# EAGLE design blimp_v1 - modified (EAGLE 9.6.2)
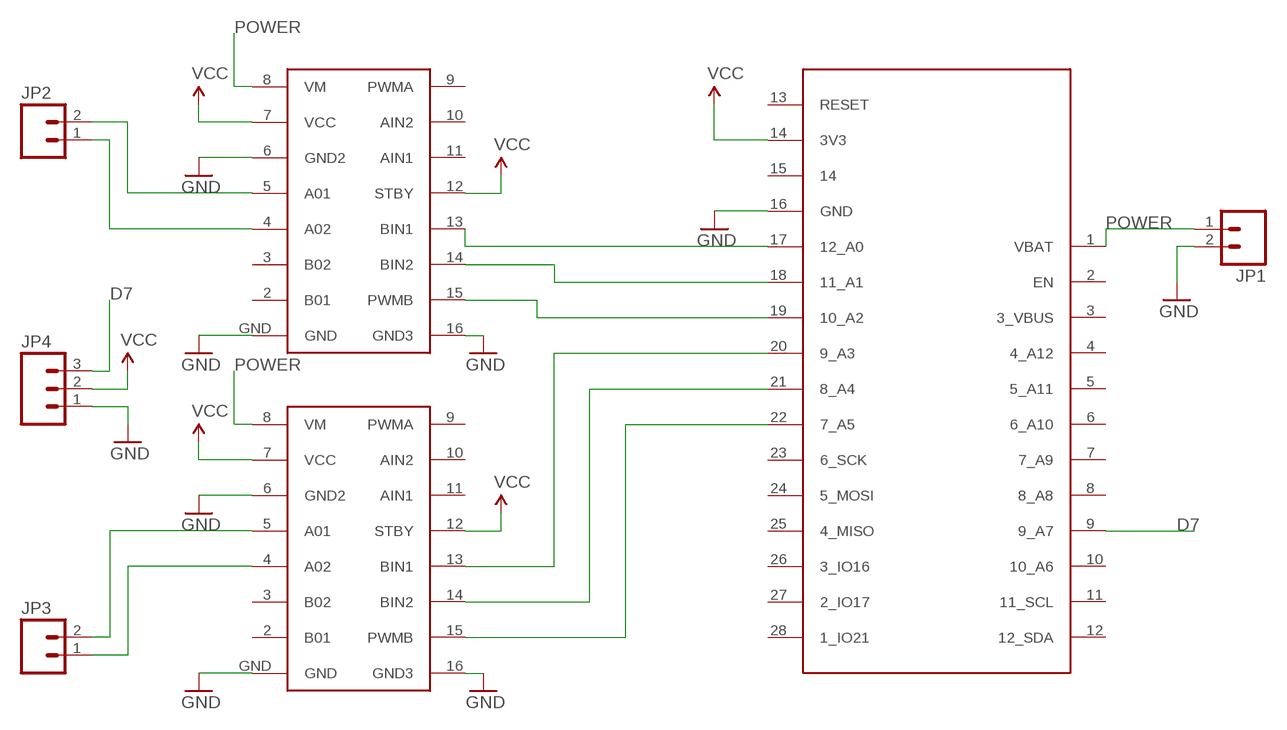
[diagram p0: schematic, sheet 1]

## Parts
JP1  M02-JST-2MM-SMT  [JST-2-SMD]
JP2  M02PTH  [1X02]
JP3  M02PTH  [1X02]
JP4  M03PTH  [1X03]
U$1  ESP32  [ESP32]
U$2  TB6612  [TB6612]
U$4  TB6612  [TB6612]

## Nets
A0: U$1.17(12_A0) U$4.13(BIN1)
D7: JP4.3 U$1.9(9_A7)
GND: JP1.2 JP4.1 U$1.16(GND) U$2.6(GND2) U$2.16(GND3) U$2.GND U$4.6(GND2) U$4.16(GND3) U$4.GND
N$1: JP2.2 U$4.5(A01)
N$2: JP2.1 U$4.4(A02)
N$3: JP3.2 U$2.5(A01)
N$4: JP3.1 U$2.4(A02)
N$5: U$1.18(11_A1) U$4.14(BIN2)
N$6: U$1.19(10_A2) U$4.15(PWMB)
N$10: U$1.20(9_A3) U$2.13(BIN1)
N$11: U$1.21(8_A4) U$2.14(BIN2)
N$12: U$1.22(7_A5) U$2.15(PWMB)
POWER: JP1.1 U$1.1(VBAT) U$2.8(VM) U$4.8(VM)
VCC: JP4.2 U$1.14(3V3) U$2.7(VCC) U$2.12(STBY) U$4.7(VCC) U$4.12(STBY)
Unconnected: U$1.2(EN) U$1.3(3_VBUS) U$1.4(4_A12) U$1.5(5_A11) U$1.6(6_A10) U$1.7(7_A9) U$1.8(8_A8) U$1.10(10_A6) U$1.11(11_SCL) U$1.12(12_SDA) U$1.13(RESET) U$1.15 U$1.23(6_SCK) U$1.24(5_MOSI) U$1.25(4_MISO) U$1.26(3_IO16) U$1.27(2_IO17) U$1.28(1_IO21) U$2.2(B01) U$2.3(B02) U$2.9(PWMA) U$2.10(AIN2) U$2.11(AIN1) U$4.2(B01) U$4.3(B02) U$4.9(PWMA) U$4.10(AIN2) U$4.11(AIN1)

## Library data of the parts
JP1-JP3 = SparkFun:M02: Header 2 Standard 2-pin 0.1" header. Use with straight break away headers (SKU : PRT-00116), right angle break away headers (PRT-00553), swiss pins (PRT-00743), machine pins (PRT-00117), and female headers (PRT-00115). Molex polarized connector foot print use with SKU : PRT-08233 with associated crimp pins and housings.
JP4 = SparkFun:M03: Header 3 Standard 3-pin 0.1" header. Use with straight break away headers (SKU : PRT-00116), right angle break away headers (PRT-00553), swiss pins (PRT-00743), machine pins (PRT-00117), and female headers (PRT-00115). Molex polarized connector foot print use with SKU : PRT-08232 with associated crimp pins and housings.
U$1 = blimp:ESP32
U$2 U$4 = blimp:TB6612

## Board
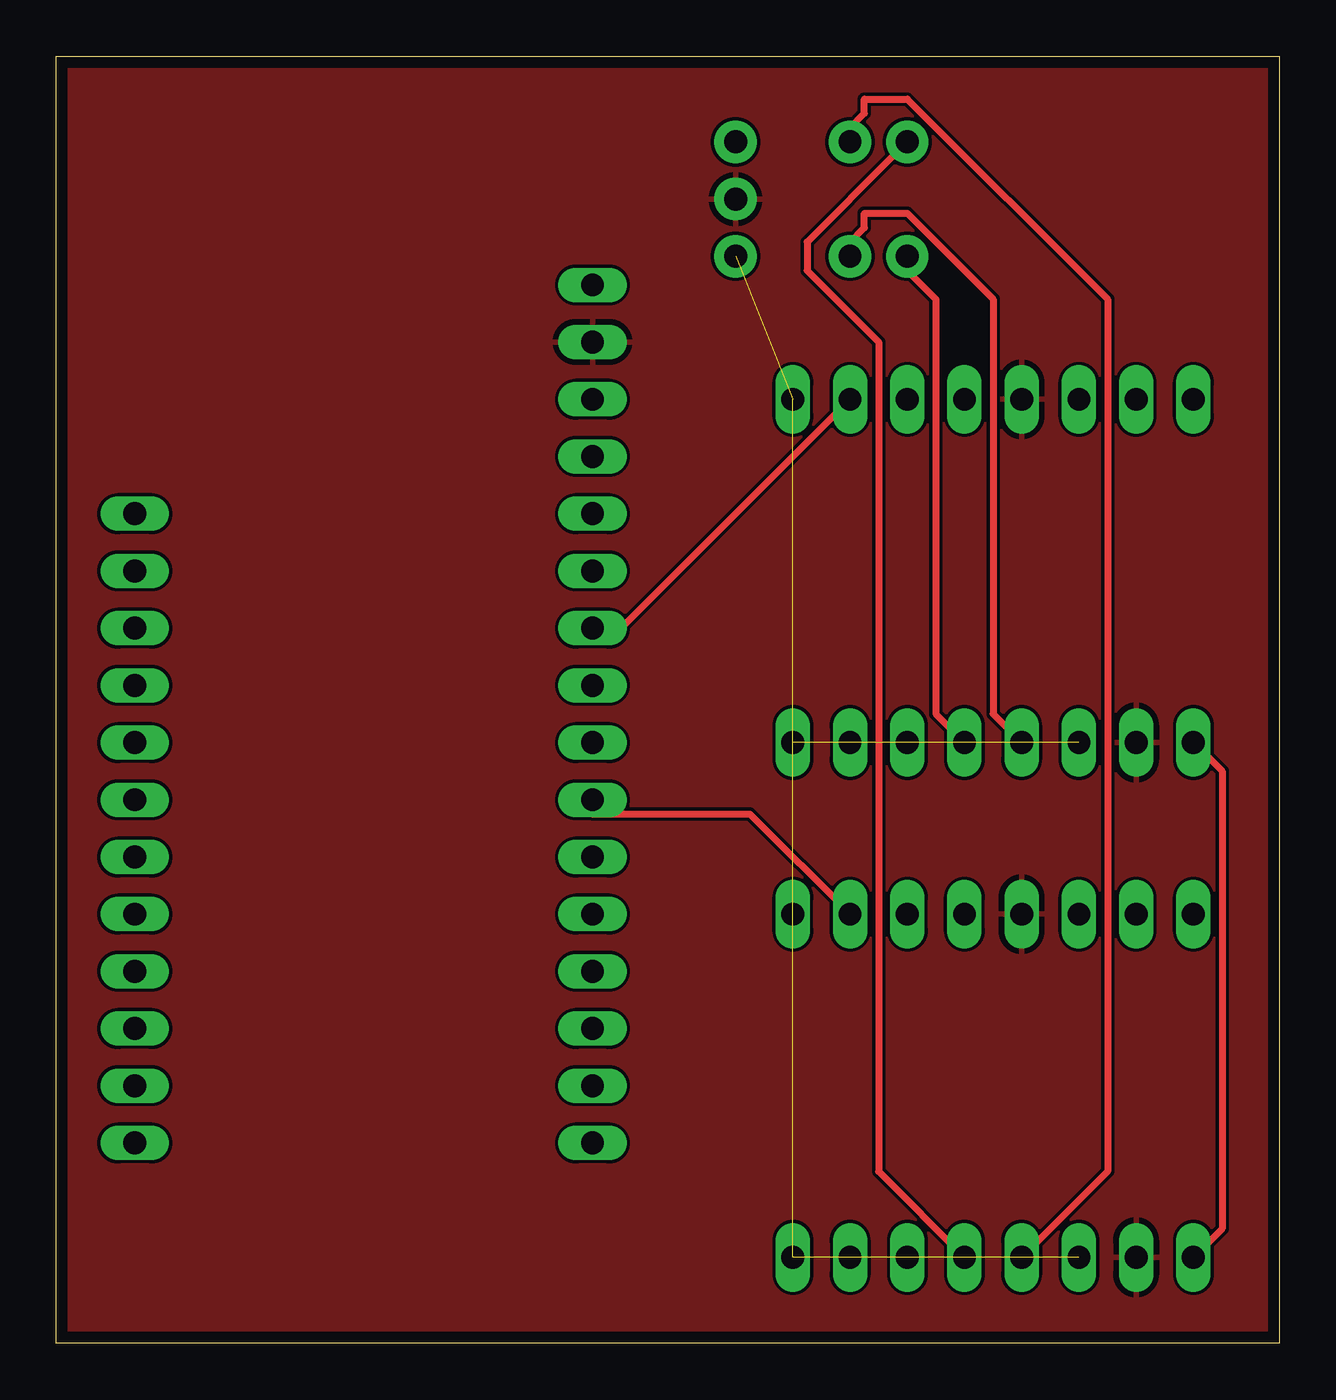
[diagram p1: board, top side]
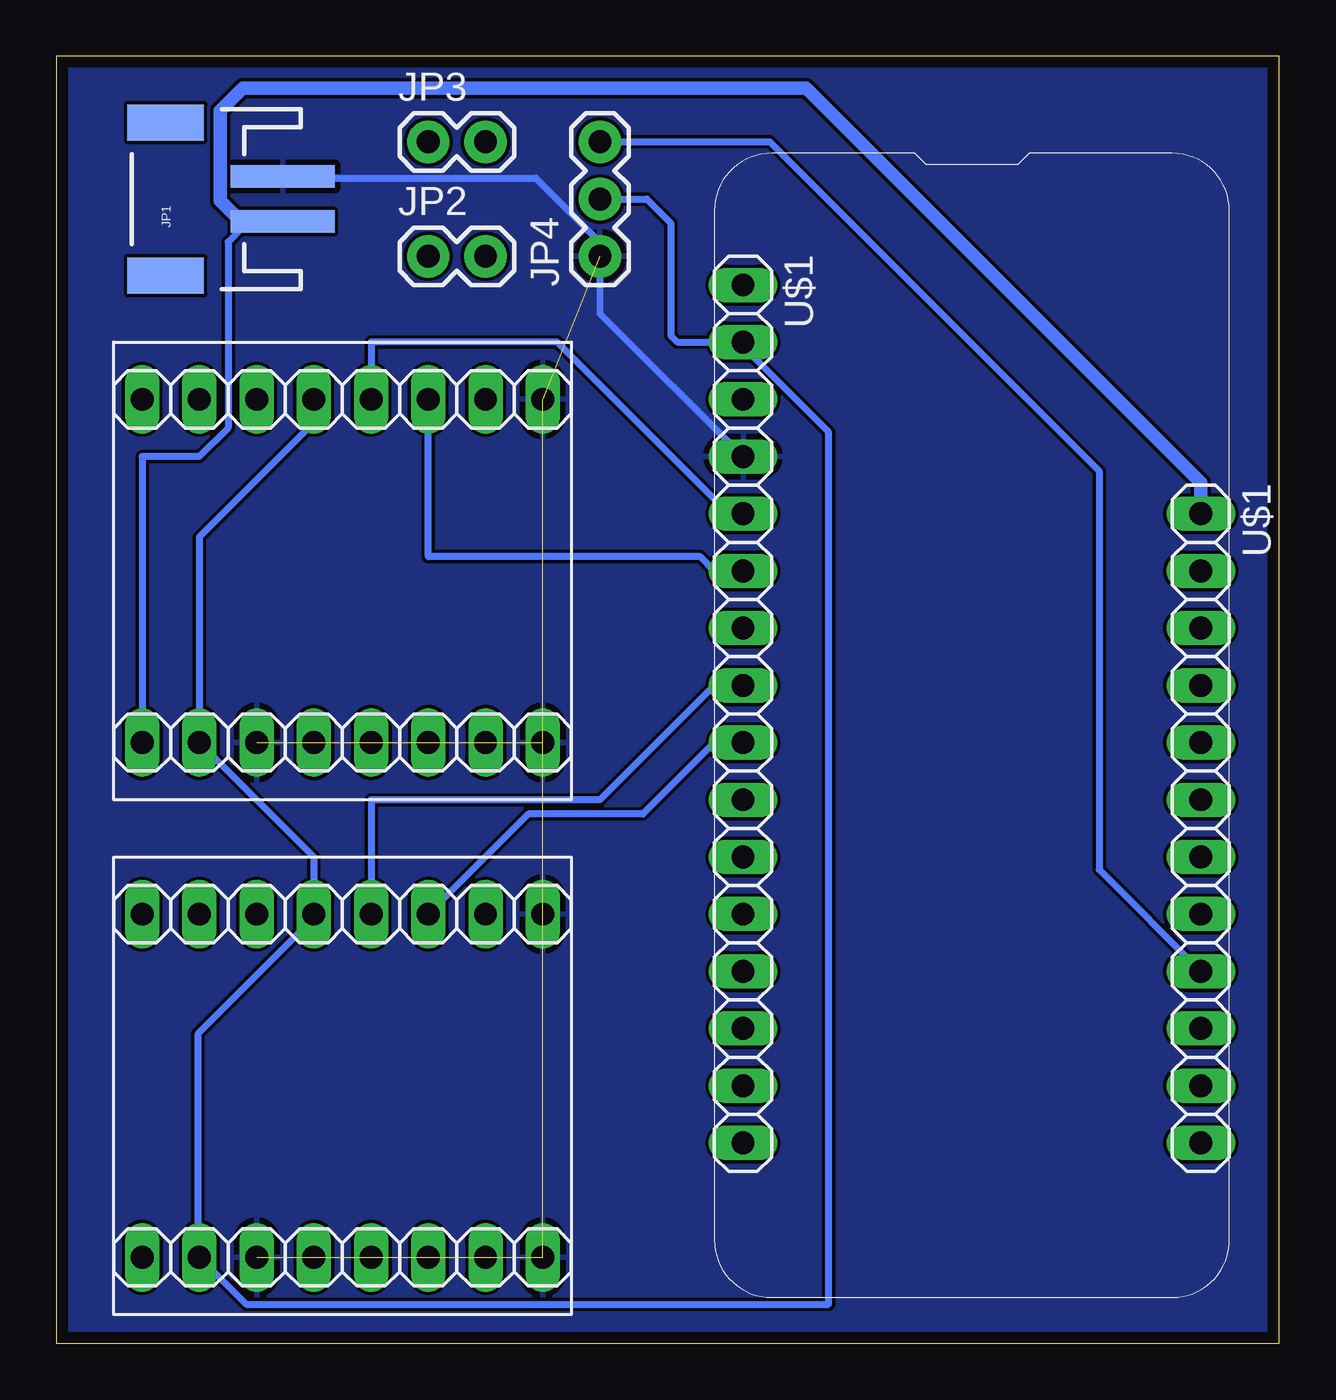
[diagram p2: board, bottom side, seen from below]

Size 54.28 x 57.14 mm. Coordinates in mm from the lower left corner, seen from the top.
Outline: 54.28,0 0,0 0,57.14 54.28,57.14 54.28,0
Copper layers (1*16): Top 0.035mm / dielectric 1.5mm / Bottom 0.035mm
Design rules "default *": minimum track width 12mil, minimum drill 0.35mm, track to track 6mil, track to pad 6mil, pad to pad 6mil, via to via 6mil, smd to smd 6mil, copper to edge 20mil, drill to drill 6mil, minimum pad ring 10mil, minimum via ring 8mil, stop-mask expansion 4mil, vias tented up to drill 0mil, thermal gap 10mil

### Footprints (pad centres in the part's own frame; a part is rotated, then mirrored left to right if it is on the bottom)
JST-2-SMD = smd 1 x 4.6: 1 -1,-3.7; 2 1,-3.7 | smd 1.6 x 3.4: NC1 -3.4,1.5; NC2 3.4,1.5
1X02 = drill 1.016 pad 1.88: 1 0,0; 2 2.54,0
1X03 = drill 1.016 pad 1.88: 1 0,0; 2 2.54,0; 3 5.08,0
ESP32 = drill 1.016 long: 1 -13.97,10.16; 2 -11.43,10.16; 3 -8.89,10.16; 4 -6.35,10.16; 5 -3.81,10.16; 6 -1.27,10.16; 7 1.27,10.16; 8 3.81,10.16; 9 6.35,10.16; 10 8.89,10.16; 11 11.43,10.16; 12 13.97,10.16; 13 -24.13,-10.16; 14 -21.59,-10.16; 15 -19.05,-10.16; 16 -16.51,-10.16; 17 -13.97,-10.16; 18 -11.43,-10.16; 19 -8.89,-10.16; 20 -6.35,-10.16; 21 -3.81,-10.16; 22 -1.27,-10.16; 23 1.27,-10.16; 24 3.81,-10.16; 25 6.35,-10.16; 26 8.89,-10.16; 27 11.43,-10.16; 28 13.97,-10.16
TB6612 = drill 1.016 long: 2 -7.62,-6.35; 3 -7.62,-3.81; 4 -7.62,-1.27; 5 -7.62,1.27; 6 -7.62,3.81; 7 -7.62,6.35; 8 -7.62,8.89; 9 7.62,8.89; 10 7.62,6.35; 11 7.62,3.81; 12 7.62,1.27; 13 7.62,-1.27; 14 7.62,-3.81; 15 7.62,-6.35; 16 7.62,-8.89; GND -7.62,-8.89

### Placement (x,y rotation side)
JP1  47.93,50.8 90 bottom
JP2  37.77,48.26 0 bottom
JP3  37.77,53.34 0 bottom
JP4  30.15,48.26 90 bottom
U$1  13.64,22.86 270 bottom
U$2  41.58,11.43 90 bottom
U$4  41.58,34.29 90 bottom

### Tracks (layer width: path | path; a pad name or v marks a point on that pad's centre or on a via)
A0
  Bottom 0.305: U$4.13 40.31,44.45 32.05,44.45 24.44,36.83 U$1.17
D7
  Bottom 0.305: JP4.3 22.61,53.34 8,38.73 8,21.03 U$1.9
GND  (6 unrouted)
  Bottom 0.305: JP1.2 44.16,51.73 33,51.73 30.15,48.88 JP4.1 30.15,45.72 U$1.16
  pour Bottom: 55.55,58.42 -1.6,58.42 -1.6,-2.54 55.55,-2.54
N$1
  Top 0.305: U$4.5 41.58,27.94 41.58,46.35 37.77,50.16 35.86,50.16 35.86,49.53 35.23,48.89 JP2.2
N$2
  Top 0.305: U$4.4 39.04,27.94 39.04,46.35 37.77,47.62 JP2.1
N$3
  Top 0.305: U$2.5 46.66,7.62 46.66,46.35 37.77,55.24 35.86,55.24 35.86,54.61 35.23,53.97 JP3.2
N$4
  Top 0.305: U$2.4 36.5,7.62 36.5,44.45 33.33,47.62 33.33,48.89 37.14,52.7 37.77,52.7 JP3.1
N$5
  Bottom 0.305: U$4.14 37.77,34.92 25.7,34.92 25.07,34.29 U$1.18
N$6
  Top 0.305: U$4.15 31.02,37.7 25.07,31.75 U$1.19
N$10
  Bottom 0.305: U$2.13 40.31,24.13 30.15,24.13 25.07,29.21 U$1.20
N$11
  Bottom 0.305: U$2.14 33.33,23.5 28.24,23.5 25.07,26.67 U$1.21
N$12
  Top 0.305: U$2.15 30.78,23.5 23.8,23.5 U$1.22
POWER
  Top 0.305: U$2.8 51.74,5.08 51.74,25.4 U$4.8
  Bottom 0.305: 44.12,50.16 JP1.1 44.75,49.53 46.03,49.53 46.66,48.89 46.66,40.64 47.93,39.37 50.47,39.37 U$4.8
  Bottom 0.61: JP1.1 46.07,49.8 47,50.73 47,54.73 46,55.73 21,55.73 3.48,38.21 U$1.1
VCC
  Bottom 0.305: JP4.2 28.07,50.8 27,49.73 27,44.73 26.72,44.45 24,44.45 | 24,44.45 U$1.14 | U$4.12 42.85,40.88 47.93,35.8 U$4.7 42.85,21.59 U$2.12 42.85,18.88 48,13.73 48,3.88 U$2.7 45.85,1.73 20,1.73 20,40.45 24,44.45
  pour Top: 56.82,60.96 -2.87,60.96 -2.87,-5.08 56.82,-5.08